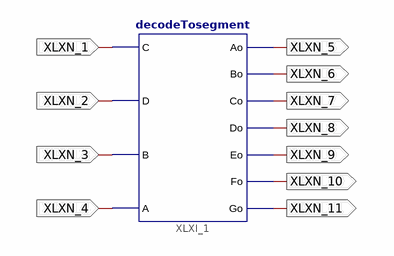
[diagram p0: schematic sheet 1]
// Xilinx ISE schematic bitAdder.sch (spartan6) as structural Verilog: 1 symbols, 11 ports
module bitAdder (
  input  XLXN_1,
  input  XLXN_2,
  input  XLXN_3,
  input  XLXN_4,
  output XLXN_5,
  output XLXN_6,
  output XLXN_7,
  output XLXN_8,
  output XLXN_9,
  output XLXN_10,
  output XLXN_11
);

  decodeTosegment XLXI_1 (
    .C(XLXN_1), .D(XLXN_2), .B(XLXN_3), .A(XLXN_4), .Ao(XLXN_5), .Bo(XLXN_6), .Co(XLXN_7), .Do(XLXN_8),
    .Eo(XLXN_9), .Fo(XLXN_10), .Go(XLXN_11));
endmodule
